# EAGLE design Stromversorgung-3 (EAGLE 7.4.0)
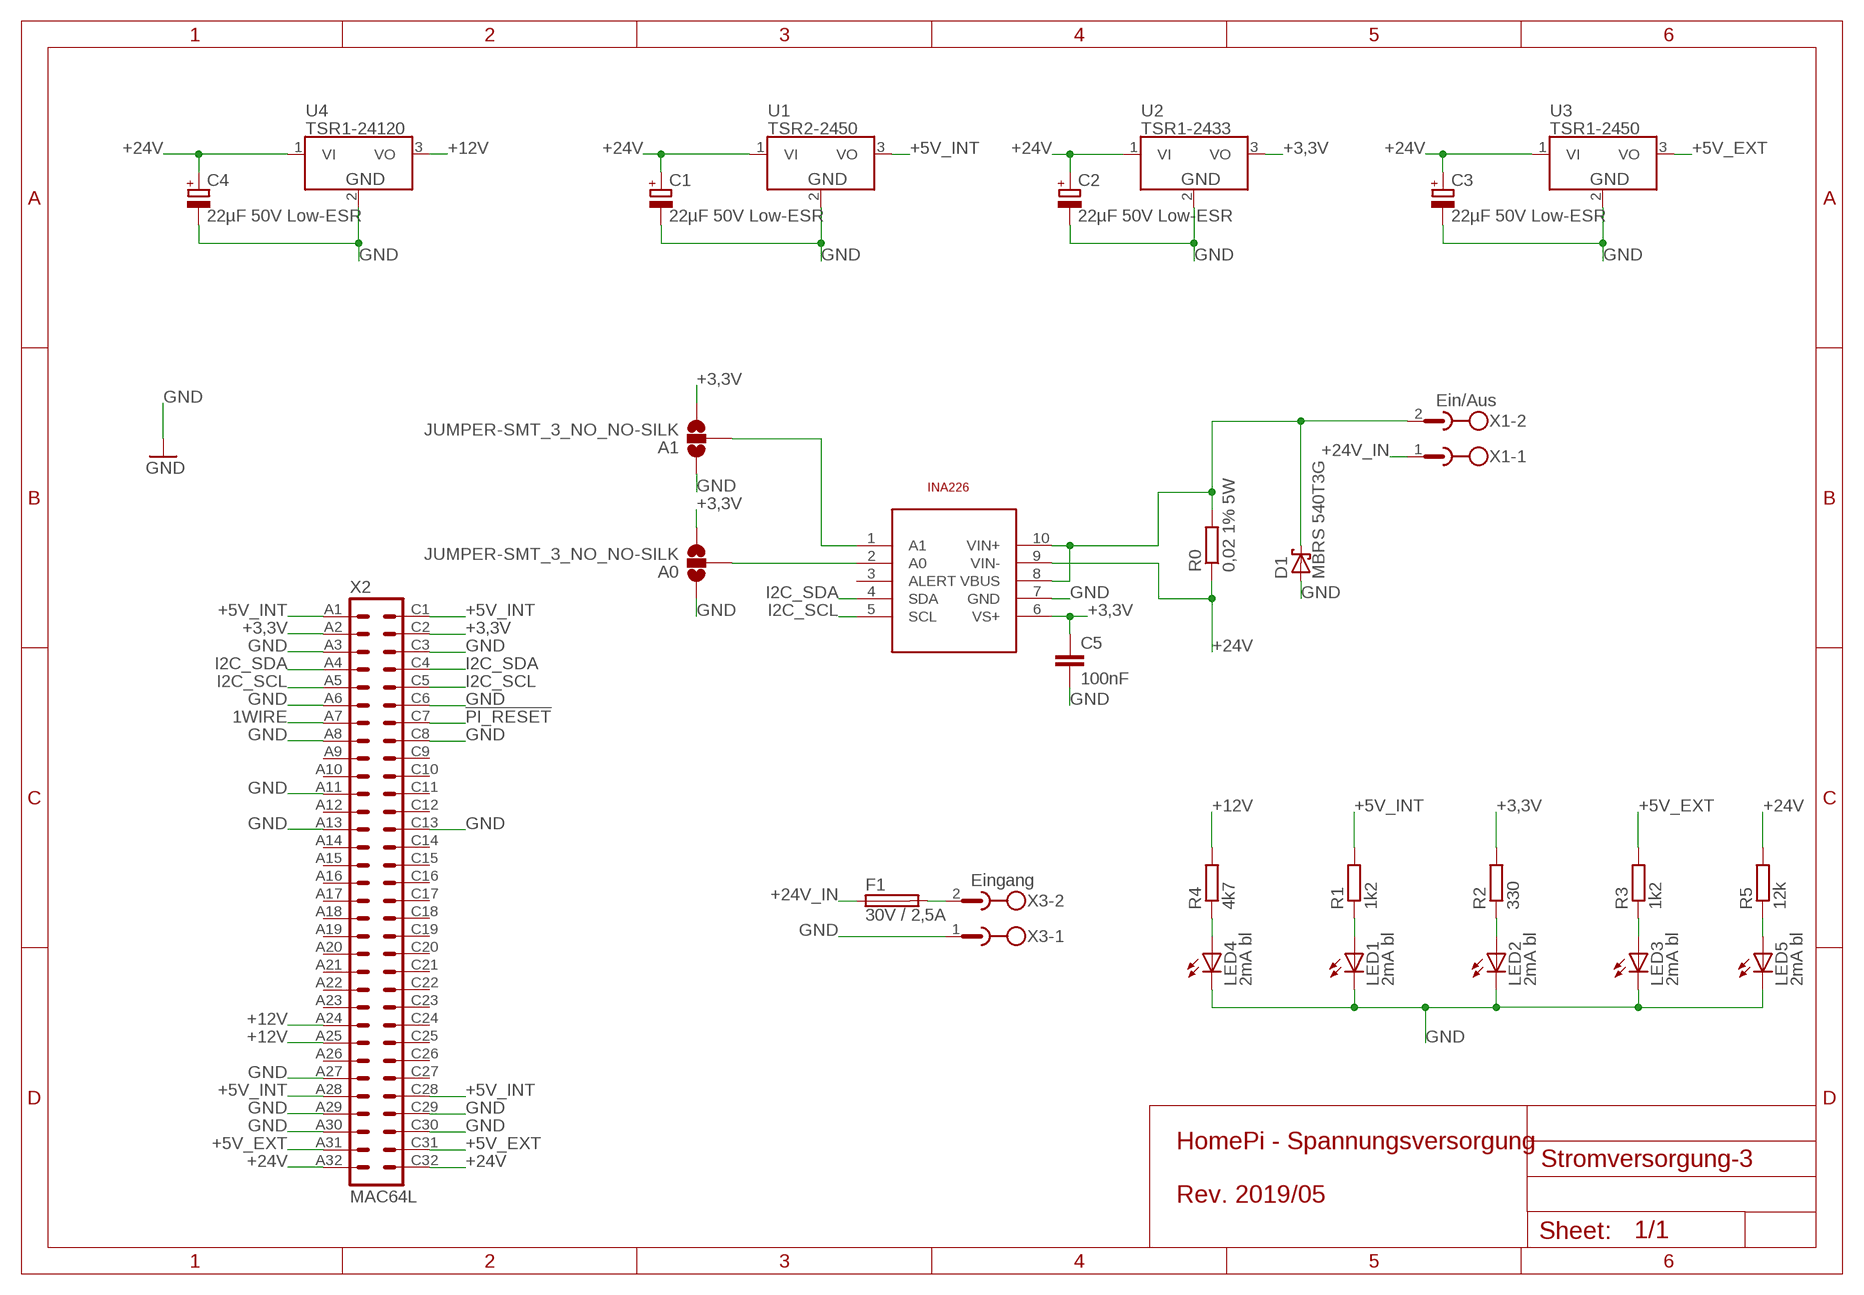
[diagram p0: schematic, sheet 1]

## Parts
A0  JUMPER-SMT_3_NO_NO-SILK  [SMT-JUMPER_3_NO_NO-SILK]
A1  JUMPER-SMT_3_NO_NO-SILK  [SMT-JUMPER_3_NO_NO-SILK]
C1  22µF 50V Low-ESR  CPOL-EUE2-5  [E2-5]
C2  22µF 50V Low-ESR  CPOL-EUE2-5  [E2-5]
C3  22µF 50V Low-ESR  CPOL-EUE2-5  [E2-5]
C4  22µF 50V Low-ESR  CPOL-EUE2-5  [E2-5]
C5  100nF  C-EUC1206  [C1206]
D1  MBRS 540T3G  SCHOTTKY-DIODESMC  [SMC]
F1  30V / 2,5A  LITTLEFUSE  [LITTLEFUSE]
IC1  TI-INA226  [TI-INA226]
LED1  2mA bl  LEDCHIPLED_1206  [CHIPLED_1206]
LED2  2mA bl  LEDCHIPLED_1206  [CHIPLED_1206]
LED3  2mA bl  LEDCHIPLED_1206  [CHIPLED_1206]
LED4  2mA bl  LEDCHIPLED_1206  [CHIPLED_1206]
LED5  2mA bl  LEDCHIPLED_1206  [CHIPLED_1206]
R0  0,02 1% 5W  R-EU_R2512  [R2512]
R1  1k2  R-EU_R1206  [R1206]
R2  330  R-EU_R1206  [R1206]
R3  1k2  R-EU_R1206  [R1206]
R4  4k7  R-EU_R1206  [R1206]
R5  12k  R-EU_R1206  [R1206]
U1  TSR2-2450  [TSR2]
U2  TSR1-2433  [TSR1]
U3  TSR1-2450  [TSR1]
U4  TSR1-24120  [TSR1]
X1  Ein/Aus  MSTBA2  [MSTBA2]
X2  MAC64L  [MAC64L]
X3  Eingang  MSTBA2  [MSTBA2]

## Nets
1WIRE: X2.A7
!PI_RESET: X2.C7
+3,3V: A0.3 A1.3 C5.1 IC1.6(VS+) R2.2 U2.3(VO) X2.A2 X2.C2
+5V_EXT: R3.2 U3.3(VO) X2.A31 X2.C31
+5V_INT: R1.2 U1.3(VO) X2.A1 X2.A28 X2.C1 X2.C28
+12V: R4.2 U4.3(VO) X2.A24 X2.A25
+24V [24V]: C1.+ C2.+ C3.+ C4.+ IC1.9(VIN-) R0.1 R5.2 U1.1(VI) U2.1(VI) U3.1(VI) U4.1(VI) X2.A32 X2.C32
+24V_1 [24V]: D1.C IC1.8(VBUS) IC1.10(VIN+) R0.2 X1.2
+24V_IN: F1.1 X1.1
+24V_IN_RAW: F1.2 X3.2
GND: A0.1 A1.1 C1.- C2.- C3.- C4.- C5.2 D1.A IC1.7(GND) LED1.C LED2.C LED3.C LED4.C LED5.C U1.2(GND) U2.2(GND) U3.2(GND) U4.2(GND) X2.A3 X2.A6 X2.A8 X2.A11 X2.A13 X2.A27 X2.A29 X2.A30 X2.C3 X2.C6 X2.C8 X2.C13 X2.C29 X2.C30 X3.1
I2C_SCL: IC1.5(SCL) X2.A5 X2.C5
I2C_SDA: IC1.4(SDA) X2.A4 X2.C4
N$1: A0.2 IC1.2(A0)
N$2: A1.2 IC1.1(A1)
N$3: LED5.A R5.1
N$6: LED1.A R1.1
N$7: LED2.A R2.1
N$8: LED3.A R3.1
N$9: LED4.A R4.1
Unconnected: IC1.3(ALERT) X2.A9 X2.A10 X2.A12 X2.A14 X2.A15 X2.A16 X2.A17 X2.A18 X2.A19 X2.A20 X2.A21 X2.A22 X2.A23 X2.A26 X2.C9 X2.C10 X2.C11 X2.C12 X2.C14 X2.C15 X2.C16 X2.C17 X2.C18 X2.C19 X2.C20 X2.C21 X2.C22 X2.C23 X2.C24 X2.C25 X2.C26 X2.C27

## Notes on the sheet
- HomePi - Spannungsversorgung
  
  Rev. 2019/05

## Library data of the parts
A0 A1 = SparkFun-Jumpers:JUMPER-SMT_3_NO: Normally open jumper This jumper has three pads in close proximity to each other. Apply solder to close the connection(s).
C1-C4 = rcl:CPOL-EU: POLARIZED CAPACITOR, European symbol
C5 = rcl:C-EU: CAPACITOR, European symbol
D1 = diode:SCHOTTKY-DIODE: Schottky Diode
F1 = fuse:LITTLEFUSE: LITTLEFUSE Picofuse/slow Littlefuse; OC_FARNELL: unknown; OC_NEWARK: unknown
IC1 = FaBo-Sensor:TI-INA226
LED1-LED5 = led:LED: LED OSRAM: - CHIPLED LG R971, LG N971, LY N971, LG Q971, LY Q971, LO R971, LY R971 LH N974, LH R974 LS Q976, LO Q976, LY Q976 LO Q996 - Hyper CHIPLED LW Q18S LB Q993, LB Q99A, LB R99A - SideLED LS A670, LO A670, LY A670, LG A670, LP A670 LB A673, LV A673, LT A673, LW A673 LH A674 LY A675 LS A676, LA A676, LO A676, LY A676, LW A676 LS A679, LY A679, LG A679 - Hyper Micro SIDELED® LS Y876, LA Y876, LO Y876, LY Y876 LT Y87S - SmartLED LW L88C, LW L88S LB L89C, LB L89S, LG L890 LS L89K, LO L89K, LY L89K LS L896, LA L896, LO L896, LY L896 - TOPLED LS T670, LO T670, LY T670, LG T670, LP T670 LSG T670, LSP T670, LSY T670, LOP T670, LYG T670 LG T671, LOG T671, LSG T671 LB T673, LV T673, LT T673, LW T673 LH T674 LS T676, LA T676, LO T676, LY T676, LB T676, LH T676, LSB T676, LW T676 LB T67C, LV T67C, LT T67C, LS T67K, LO T67K, LY T67K, LW E67C LS E67B, LA E67B, LO E67B, LY E67B, LB E67C, LV E67C, LT E67C LW T67C LS T679, LY T679, LG T679 LS T770, LO T770, LY T770, LG T770, LP T770 LB T773, LV T773, LT T773, LW T773 LH T774 LS E675, LA E675, LY E675, LS T675 LS T776, LA T776, LO T776, LY T776, LB T776 LHGB T686 LT T68C, LB T68C - Hyper Mini TOPLED® LB M676 - Mini TOPLED Santana® LG M470 LS M47K, LO M47K, LY M47K Source: http://www.osram.convergy.de LUXEON: - LUMILED® LXK2-PW12-R00, LXK2-PW12-S00, LXK2-PW14-U00, LXK2-PW14-V00 LXK2-PM12-R00, LXK2-PM12-S00, LXK2-PM14-U00 LXK2-PE12-Q00, LXK2-PE12-R00, LXK2-PE12-S00, LXK2-PE14-T00, LXK2-PE14-U00 LXK2-PB12-K00, LXK2-PB12-L00, LXK2-PB12-M00, LXK2-PB14-N00, LXK2-PB14-P00, LXK2-PB14-Q00 LXK2-PR12-L00, LXK2-PR12-M00, LXK2-PR14-Q00, LXK2-PR14-R00 LXK2-PD12-Q00, LXK2-PD12-R00, LXK2-PD12-S00 LXK2-PH12-R00, LXK2-PH12-S00 LXK2-PL12-P00, LXK2-PL12-Q00, LXK2-PL12-R00 Source: www.luxeon.com KINGBRIGHT: KA-3528ASYC Source: www.kingbright.com
R0 R1-R5 = rcl:R-EU_: RESISTOR, European symbol
U1 = TSR:TSR2-*: TSR 2 Series, 1 A The new TSR 2 series step-down switching regulators are drop-in replacement for inefficient LMxx linear regulators. A high efficiency up to 96 % allows full load operation up to +67°C ambient temperature without the need of any heat-sink or forced cooling.The TSR 2 switching regulators provide other significant features over linear regulators, i.e. better output accuracy (±2 %), lower standby current of 2 mA and no requirement of external capacitors. The high efficiency and low standby power consumption makes these regulators an ideal solution for many battery powered applications.
U2-U4 = TSR:TSR1-*: TSR 1 Series, 1 Amp The TSR-1 series step-down switching regulators are drop-in replacement for inefficient 78xx linear regulators. A high efficiency up to 96 % allows full load operation up to +60 °C ambient temperature without the need of any heat-sink or forced cooling. The TSR-1 switching regulators provide other significant fea-tures over linear regulators, i.e. better output accuracy (±2 %), lower standby current of 2 mA and no requirement of external capacitors. The high efficiency and low standby power consumption makes these regulators an ideal solution for many battery powered applications.
X1 X3 = con-phoenix-508:MSTBA2: PHOENIX; MF: FARNELL; MPN: 1757242; OC_FARNELL: 3705171; OC_NEWARK: 71C4161
X2 = con-vg:MAC64L: CONNECTOR male, 64 pins, block, type C, rows AC, grid 5.08 mm

## Net classes
1 24V: clearance 0.406 mm

## Board
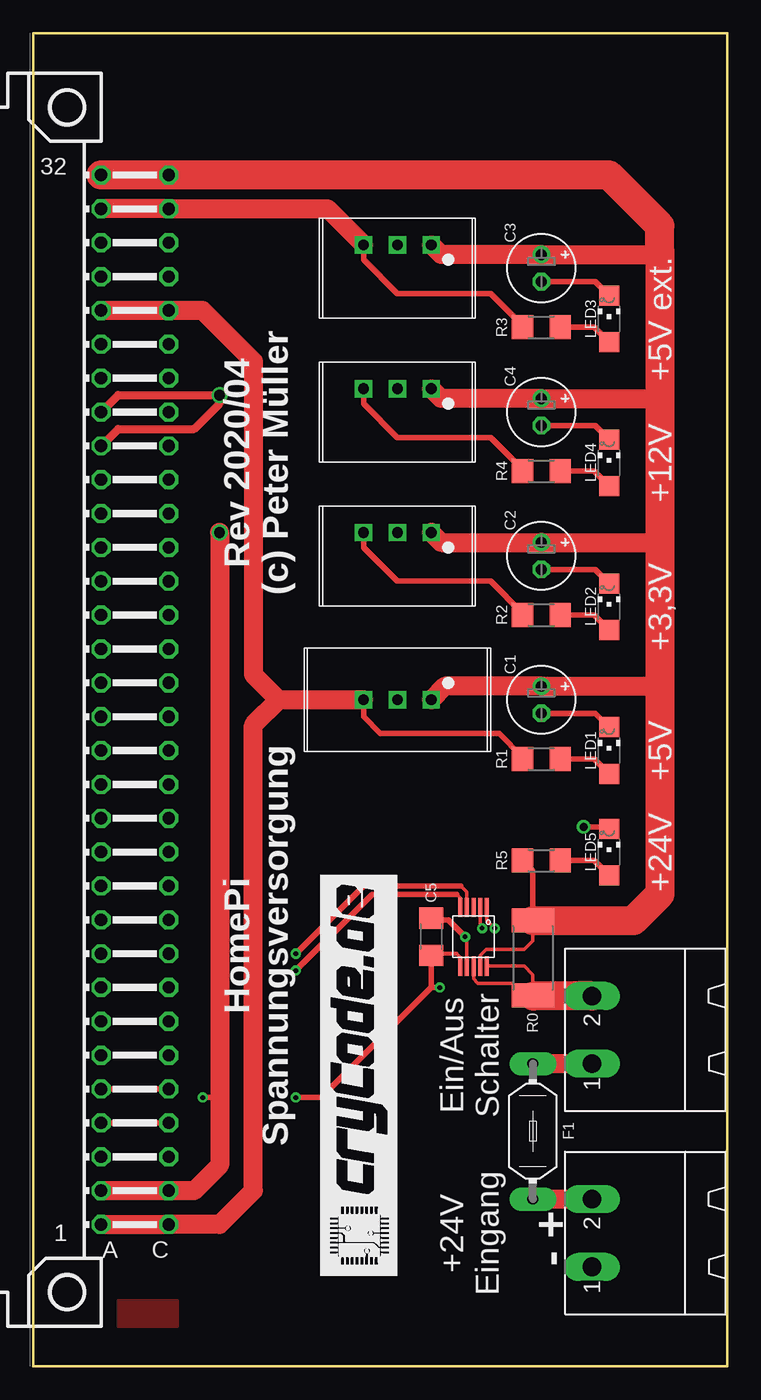
[diagram p1: board, top side]
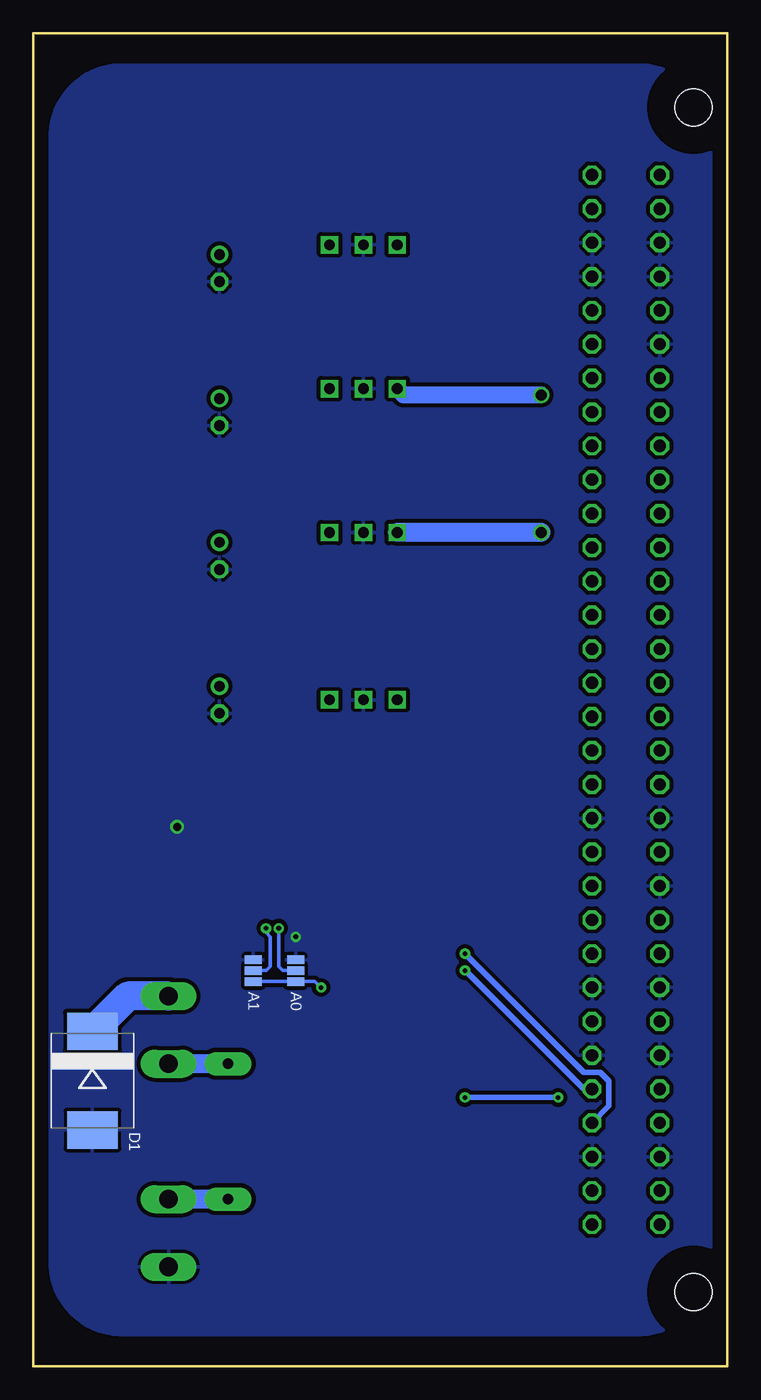
[diagram p2: board, bottom side, seen from below]

Size 52.06 x 100 mm. Coordinates in mm from the lower left corner, seen from the top.
Outline: 0,0 52.06,0 52.06,100 0,100 0,0
Copper layers (1*16): Top 0.035mm / dielectric 1.5mm / Bottom 0.035mm
Design rules "allpcb2 *": minimum track width 8mil, minimum drill 0.3mm, track to track 6mil, track to pad 6mil, pad to pad 6mil, via to via 6mil, smd to smd 6mil, copper to edge 40mil, drill to drill 8mil, minimum pad ring 10mil, minimum via ring 8mil, stop-mask expansion 0.1mm, vias tented up to drill 1mm, thermal gap 10mil

### Footprints (pad centres in the part's own frame; a part is rotated, then mirrored left to right if it is on the bottom)
SMT-JUMPER_3_NO_NO-SILK = smd 0.635 x 1.27: 1 -0.813,0; 2 0,0; 3 0.813,0
E2-5 = drill 0.813 pad 1.27: + -1.016,0 | drill 0.813 pad 1.27 octagon: - 1.016,0
C1206 = smd 1.6 x 1.8: 1 -1.4,0; 2 1.4,0
SMC = smd 2.8 x 3.8: A 3.7,0; C -3.7,0
LITTLEFUSE = drill 0.813 pad 1.778 long: 1 -5.08,0; 2 5.08,0
TI-INA226 = smd 1.45 x 0.3: 1 -2.2,1; 2 -2.2,0.5; 3 -2.2,0; 4 -2.2,-0.5; 5 -2.2,-1; 6 2.2,-1; 7 2.2,-0.5; 8 2.2,0; 9 2.2,0.5; 10 2.2,1
CHIPLED_1206 = smd 1.5 x 1.5: A 0,-1.75; C 0,1.75
R2512 = smd 1.8 x 3.2: 1 -2.8,0; 2 2.8,0
R1206 = smd 1.6 x 1.803: 1 -1.422,0; 2 1.422,0
TSR2 = drill 0.8 square: 1 -2.54,0; 2 0,0; 3 2.54,0
TSR1 = drill 0.8 square: 1 -2.54,-1.75; 2 0,-1.75; 3 2.54,-1.75
MSTBA2 = drill 1.397 long: 1 -2.54,5.08; 2 2.54,5.08
MAC64L = drill 0.914 octagon: A1 -2.54,39.37; A2 -2.54,36.83; A3 -2.54,34.29; A4 -2.54,31.75; A5 -2.54,29.21; A6 -2.54,26.67; A7 -2.54,24.13; A8 -2.54,21.59; A9 -2.54,19.05; A10 -2.54,16.51; A11 -2.54,13.97; A12 -2.54,11.43; A13 -2.54,8.89; A14 -2.54,6.35; A15 -2.54,3.81; A16 -2.54,1.27; A17 -2.54,-1.27; A18 -2.54,-3.81; A19 -2.54,-6.35; A20 -2.54,-8.89; A21 -2.54,-11.43; A22 -2.54,-13.97; A23 -2.54,-16.51; A24 -2.54,-19.05; A25 -2.54,-21.59; A26 -2.54,-24.13; A27 -2.54,-26.67; A28 -2.54,-29.21; A29 -2.54,-31.75; A30 -2.54,-34.29; A31 -2.54,-36.83; A32 -2.54,-39.37; C1 -7.62,39.37; C2 -7.62,36.83; C3 -7.62,34.29; C4 -7.62,31.75; C5 -7.62,29.21; C6 -7.62,26.67; C7 -7.62,24.13; C8 -7.62,21.59; C9 -7.62,19.05; C10 -7.62,16.51; C11 -7.62,13.97; C12 -7.62,11.43; C13 -7.62,8.89; C14 -7.62,6.35; C15 -7.62,3.81; C16 -7.62,1.27; C17 -7.62,-1.27; C18 -7.62,-3.81; C19 -7.62,-6.35; C20 -7.62,-8.89; C21 -7.62,-11.43; C22 -7.62,-13.97; C23 -7.62,-16.51; C24 -7.62,-19.05; C25 -7.62,-21.59; C26 -7.62,-24.13; C27 -7.62,-26.67; C28 -7.62,-29.21; C29 -7.62,-31.75; C30 -7.62,-34.29; C31 -7.62,-36.83; C32 -7.62,-39.37 | hole 2.794: 0,44.45; 0,-44.45

### Placement (x,y rotation side)
A0  32.38,29.68 270 bottom
A1  35.56,29.68 270 bottom
C1  38.1,50 270 top
C2  38.1,60.8 270 top
C3  38.1,82.39 270 top
C4  38.1,71.59 270 top
C5  29.84,32.22 90 top
D1  47.62,21.42 270 bottom
F1  37.47,17.61 270 top
IC1  33.02,32.22 270 top
LED1  43.18,46.19 0 top
LED2  43.18,56.98 0 top
LED3  43.18,78.58 0 top
LED4  43.18,67.78 0 top
LED5  43.18,38.57 0 top
R0  37.47,30.63 270 top
R1  38.1,45.55 180 top
R2  38.1,56.35 180 top
R3  38.1,77.94 180 top
R4  38.1,67.14 180 top
R5  38.1,37.94 180 top
U1  27.3,50 180 top
U2  27.3,60.8 180 top
U3  27.3,82.39 180 top
U4  27.3,71.59 180 top
U$1  [30MM]  27.3,6.82 90 top
X1  46.99,25.23 90 top
X2  2.54,50 180 top
X3  46.99,10 90 top

### Tracks (layer width: path | path; a pad name or v marks a point on that pad's centre or on a via)
+3,3V  (via drill 0.35 pad 0.7, 0.8)
  Top 0.254: IC1.6 32.02,30.68 31.75,30.95
  Top 0.305: 31.75,30.95 29.98,30.95 C5.1
  Top 0.406: 29.71,30.82 C5.1 29.84,28.41 | v19.68,20.15 21.59,20.15 29.84,28.41 | v12.7,20.15 13.97,20.15 | v30.48,28.41 29.84,28.41 | R2.2 36.68,56.5 34.29,58.89 27.3,58.89 24.77,61.43 U2.3
  Top 1.422: X2.A2 X2.C2 12.06,13.17 13.97,15.08 13.97,20.15 v13.97,62.55
  Bottom 0.254: A1.3 A0.3 30.94,28.87 v30.48,28.41
  Bottom 0.406: v19.68,20.15 v12.7,20.15
  Bottom 1.422: v13.97,62.55 U2.3
+5V_EXT
  Top 0.406: R3.2 36.68,78.09 34.29,80.48 27.3,80.48 24.77,83.02 U3.3
  Top 1.422: X2.A31 X2.C31 22.07,86.83 U3.3
+5V_INT
  Top 0.406: R1.2 36.68,45.71 34.92,47.46 26.04,47.46 24.77,48.73 U1.3
  Top 1.422: X2.A1 X2.C1 13.97,10.63 16.51,13.17 16.51,48.09 18.41,50 | X2.A28 X2.C28 12.7,79.21 16.51,75.4 16.51,51.91 18.41,50 | U1.3 18.41,50
+12V  (via drill 0.8)
  Top 0.406: R4.2 36.68,67.3 34.29,69.69 27.3,69.69 24.77,72.22 U4.3
  Top 0.61: X2.A25 6.35,72.86 v13.97,72.86 13.97,72.22 12.06,70.32 6.35,70.32 X2.A24
  Bottom 1.27: v13.97,72.86 24.29,72.86 U4.3
+24V
  Top 0.254: R0.1 37.47,31.9 36.83,31.27 33.97,31.27 33.52,30.81 IC1.9
  Top 0.406: R5.2 37.47,37.15 R0.1
  Top 1.422: 46.99,83.66 46.74,83.4 C3.+ 30.58,83.4 U3.1 | 46.99,51.27 46.74,51.02 C1.+ 30.86,51.02 U1.1 | U4.1 30.58,72.61 C4.+ 46.74,72.61 46.99,72.86 | 46.84,62.55 46.99,62.7 | U2.1 30.58,61.81 C2.+ 46.74,61.81 46.99,62.06
  Top 2.184: X2.A32 X2.C32 43.18,89.37 46.99,85.56 46.99,83.66 46.99,72.86 46.99,62.7 46.99,62.06 46.99,51.27 46.99,35.39 45.03,33.43 R0.1
+24V_1
  Top 0.254: IC1.10 36.81,30.02 37.47,29.36 R0.2 37.41,27.77 36.83,27.77 35.88,28.73 33.34,28.73 33.02,29.04 IC1.8
  Top 0.406: 37.52,27.77 R0.2
  Top 2.184: X1.2 37.52,27.77
  Bottom 2.184: X1.2 44.98,27.77 D1.C
+24V_IN
  Top 1.422: X1.1 F1.1
  Bottom 1.422: F1.1 X1.1
+24V_IN_RAW
  Top 1.422: X3.2 F1.2
  Bottom 1.422: F1.2 X3.2
GND  (via drill 0.35 pad 0.7, 0.6)
  Top 0.254: IC1.7 32.52,32.09 v32.38,32.22
  Top 0.406: v32.38,32.22 31.11,33.49 29.98,33.49 C5.2 | C4.- 42.14,70.57 LED4.C | C3.- 42.14,81.37 LED3.C | C1.- 42.14,48.98 LED1.C | LED5.C 43.02,40.48 v41.27,40.48 | LED2.C 42.14,59.78 C2.-
  pour Bottom (isolate 0.305): 1.27,91.91 arc-97 6.99,97.62 45.09,97.62 arc-97 50.8,91.91 50.8,8.09 arc-97 45.09,2.38 6.99,2.38 arc-97 1.27,8.09
  pour Bottom: 6.35,4.92 10.79,4.92 10.79,3.01 6.35,3.01
I2C_SCL  (via drill 0.35 pad 0.7)
  Top 0.254: IC1.5 32.02,35.12 31.75,35.39
  Top 0.406: v19.68,29.68 25.4,35.39 31.75,35.39 | X2.C5 X2.A5
  Bottom 0.406: X2.C5 10.79,20.79 v19.68,29.68
I2C_SDA  (via drill 0.35 pad 0.7)
  Top 0.254: IC1.4 32.52,35.58 32.07,36.03
  Top 0.406: 32.07,36.03 24.77,36.03 v19.68,30.95 | X2.A4 X2.C4
  Bottom 0.406: v19.68,30.95 10.79,22.06 9.53,22.06 8.89,21.42 8.89,19.52 X2.C4
N$1  (via drill 0.35 pad 0.7)
  Top 0.254: IC1.2 33.52,32.99 v33.66,32.85
  Bottom 0.254: v33.66,32.85 33.66,30 33.34,29.68 A0.2
N$2  (via drill 0.35 pad 0.7)
  Top 0.254: IC1.1 34.02,33.44 v34.61,32.85
  Bottom 0.254: v34.61,32.85 34.61,32.54 34.29,32.22 34.29,30 34.61,29.68 A1.2
N$3
  Top 0.406: LED5.A 42.06,37.94 R5.1
N$6
  Top 0.406: R1.1 42.06,45.55 LED1.A
N$7
  Top 0.406: R2.1 42.06,56.35 LED2.A
N$8
  Top 0.406: LED3.A 42.06,77.94 R3.1
N$9
  Top 0.406: R4.1 42.06,67.14 LED4.A
TOP
  pour Top: 6.35,4.92 10.79,4.92 10.79,3.01 6.35,3.01

### Text on the board
tNames: +5V ext. | Rev 2020/04 / (c) Peter Müller | +12V | +3,3V | +5V | +24V | HomePi / Spannungsversorgung | Ein/Aus / Schalter | +24V / Eingang | + | -
tRestrict: TOP
bRestrict: BOT